# Altium schematic sheet TempSensor — копия.SchDoc
size 420 x 297 mm
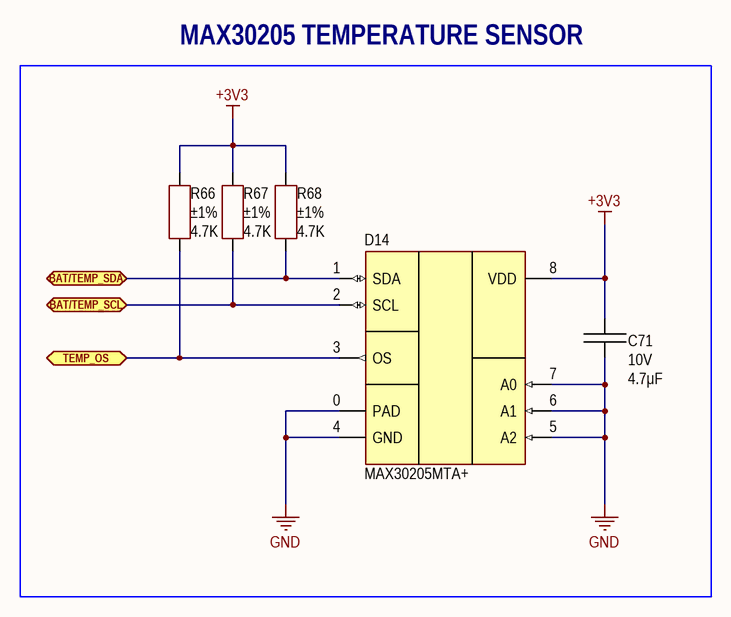
[diagram p0: TempSensor — копия.SchDoc]

## Parts
C71  value 4.7μF  Voltage: 10V  [CAP: 0805]
D14  (no value)  [8-TDFN]
R66  value 4.7K  Tolerance: ±1%  [RES: 0805]
R67  value 4.7K  Tolerance: ±1%  [RES: 0805]
R68  value 4.7K  Tolerance: ±1%  [RES: 0805]

## Blocks framed on the sheet
MAX30205 TEMPERATURE SENSOR: C71 D14 R66-R68

## Ports
BAT/TEMP_SCL (bidir), BAT/TEMP_SDA (bidir), TEMP_OS (bidir)

## Nets
+3V3: C71.2 D14.8(VDD) R66.1 R67.1 R68.1
GND: C71.1 D14.0(PAD) D14.4(GND) D14.5(A2) D14.6(A1) D14.7(A0)
BAT/TEMP_SCL: D14.2(SCL) R67.2 ; port BAT/TEMP_SCL
BAT/TEMP_SDA: D14.1(SDA) R68.2 ; port BAT/TEMP_SDA
TEMP_OS: D14.3(OS) R66.2 ; port TEMP_OS

## Notes on the sheet
- Author
- Manufacturer
- Date
- Page
- Total pages
- Size page
- A3
- Materials

## Library data of the parts
C71 = Ceramic_0805: 4.7 µF ±10% 16V Ceramic Capacitor X7R 0805 (2012 Metric); Manufacturer: Yageo; PartNumber: CC0805KKX7R7BB475; ValueManufacturerPartNumber: Ceramic capacitor, 4.7μF, X7R, ±10%, 10V, 0805, -55...+125°C; Package: 0805; HelpURL: https://www.digikey.com/en/products/detail/yageo/CC0805KKX7R7BB475/5195289; Temperature: -55...+125°C; TypeCapacitor: Ceramic capacitor; Tolerance: ±10%; TypeDielectric: X7R
D14 = MAX30205MTA+: Temperature sensor; Manufacturer: Maxim Integrated; Supply: 2.7...3.3V; Accuracy: ±0.1°C; Sensing: Human Body Temperature Sensor; HelpURL: https://www.digikey.com/en/products/detail/maxim-integrated/MAX30205MTA-T/5880761; Package: 8-TDFN; ComponentType: IC temperature sensor; ValueManufacturerPartNumber: =ComponentType+', '+Sensing+', '+Accuracy+', '+GainBandwidth+', '+Sensitivity+', '+Temperature+', '+Package; Temperature: 0...+50°C; PartNumber: MAX30205MTA+
R66-R68 = Resistor_0805: 4.7 kOhms ±5% 0.125W, 1/8W Chip Resistor 0805 (2012 Metric) Moisture Resistant Thick Film; Manufacturer: Yageo; PartNumber: RC0805JR-074K7L; ValueManufacturerPartNumber: Resistor film, 4.7K, ±1%, 0805, 0.125W, -55...+125°C; TypeResistor: Resistor film; Package: 0805; HelpURL: https://www.digikey.com/en/products/detail/yageo/RC0805JR-074K7L/728327; Temperature: -55...+125°C; Power: 0.125W